# Altium schematic sheet main.SchDoc
size A4
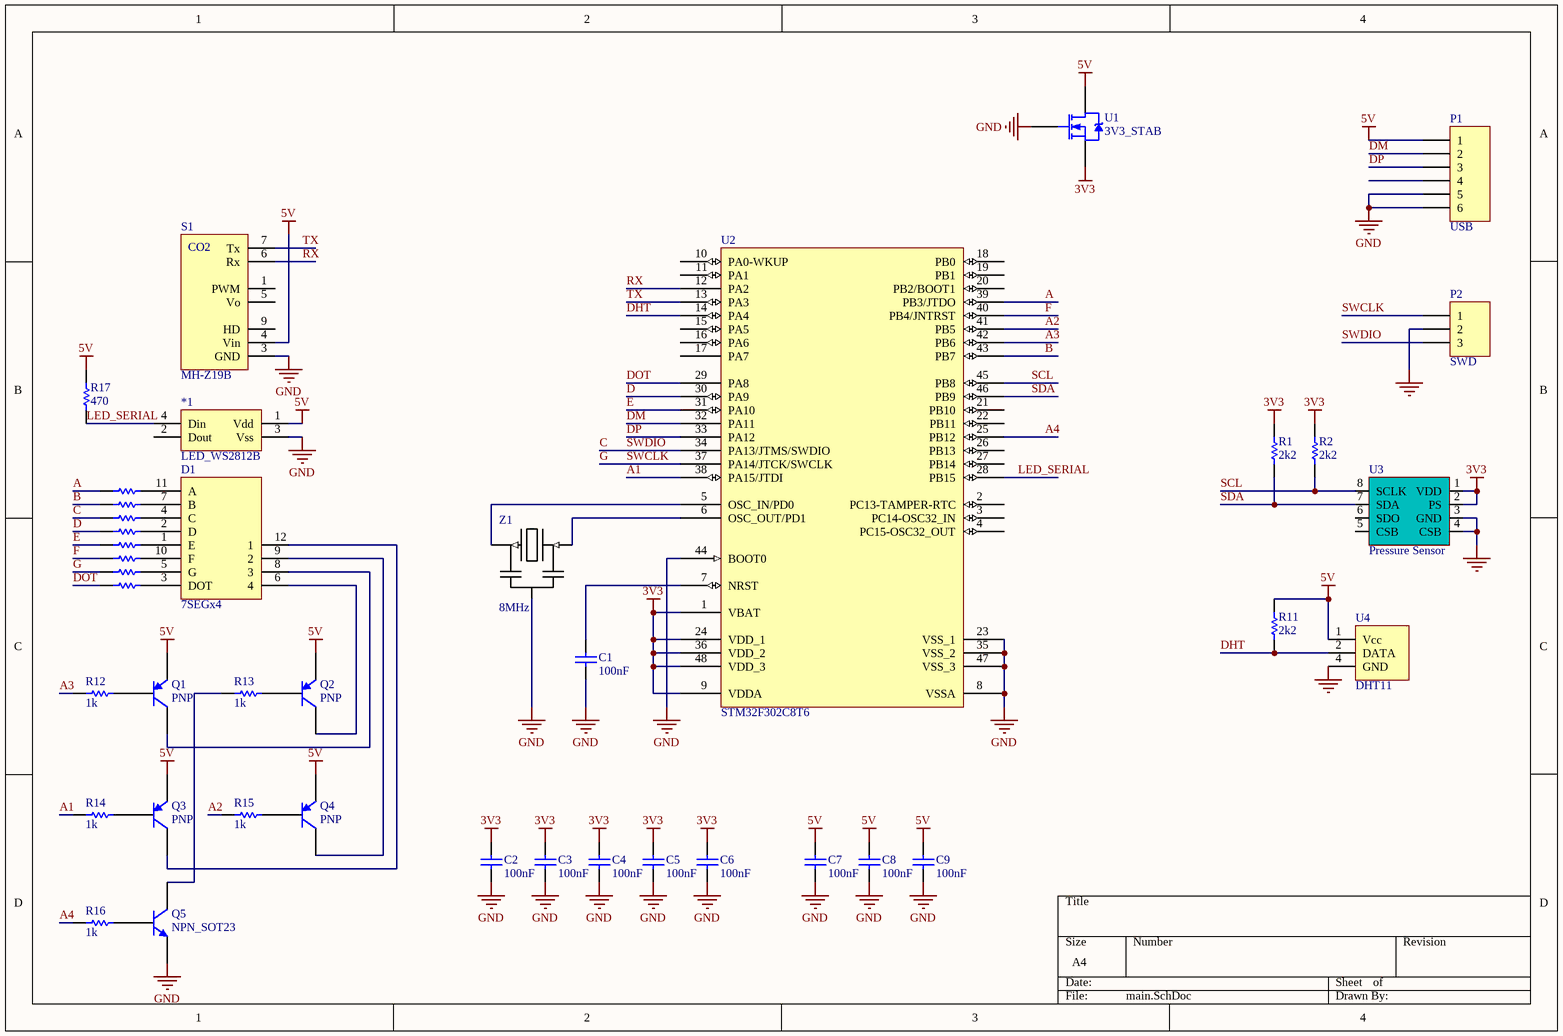
[diagram p0: main.SchDoc]

## Parts
*1  LED_WS2812B  [LED_WS2812b]
C1  100nF  [RC_0603]
C2  100nF  [RC_0603]
C3  100nF  [RC_0603]
C4  100nF  [RC_0603]
C5  100nF  [RC_0603]
C6  100nF  [RC_0603]
C7  100nF  [RC_0603]
C8  100nF  [RC_0603]
C9  100nF  [RC_0603]
D1  7SEGx4  [7SEG_4X_MEDIUM]
P1  USB  [RR_USB_MICRO_#1]
P2  SWD  [MHDR1X3]  (graphical)
Q1  PNP  [SOT-23B_L]
Q2  PNP  [SOT-23B_L]
Q3  PNP  [SOT-23B_L]
Q4  PNP  [SOT-23B_L]
Q5  NPN_SOT23  [SOT-23B_L]
R1  2k2  [RR_0603]
R2  2k2  [RR_0603]
R3  220  [RR_0603]  (value not drawn)
R4  220  [RR_0603]  (value not drawn)
R5  220  [RR_0603]  (value not drawn)
R6  220  [RR_0603]  (value not drawn)
R7  220  [RR_0603]  (value not drawn)
R8  220  [RR_0603]  (value not drawn)
R9  220  [RR_0603]  (value not drawn)
R10  220  [RR_0603]  (value not drawn)
R11  2k2  [RR_0603]
R12  1k  [RR_0603]
R13  1k  [RR_0603]
R14  1k  [RR_0603]
R15  1k  [RR_0603]
R16  1k  [RR_0603]
R17  470  [RR_0603]
S1  MH-Z19B  [MH_Z19B]
U1  3V3_STAB  [RR_SOT-23]
U2  STM32F302C8T6  [LQFP48_N]
U3  Pressure Sensor  [MS5611-01BA03]
U4  DHT11  [DHT11]
Z1  8MHz  [RR_CRYSTAL_3.2X1.3]

## Nets
3V3: C2.2 C3.2 C4.2 C5.2 C6.2 R1.2 R2.2 U1.2(S) U2.1(VBAT) U2.9(VDDA) U2.24(VDD_1) U2.36(VDD_2) U2.48(VDD_3) U3.1(VDD) U3.2(PS)
5V: *1.1(Vdd) C7.2 C8.2 C9.2 P1.1 Q1.2(E) Q2.2(E) Q3.2(E) Q4.2(E) R11.2 R17.2 S1.4(Vin) U1.3(D) U4.1(Vcc)
GND: *1.3(Vss) C1.1 C2.1 C3.1 C4.1 C5.1 C6.1 C7.1 C8.1 C9.1 P1.5 P1.6 P2.2 Q5.2(E) S1.3(GND) U1.1(G) U2.8(VSSA) U2.23(VSS_1) U2.35(VSS_2) U2.44(BOOT0) U2.47(VSS_3) U3.3(GND) U3.4(CSB) U4.4(GND) Z1.2(GND)
A: R3.1 U2.39(PB3/JTDO)
A1: R14.1 U2.38(PA15/JTDI)
A2: R15.1 U2.41(PB5)
A3: R12.1 U2.42(PB6)
A4: R16.1 U2.25(PB12)
B: R4.1 U2.43(PB7)
C: P2.3 R5.1 U2.34(PA13/JTMS/SWDIO)  [also labelled SWDIO]
D: R6.1 U2.30(PA9)
DHT: R11.1 U2.14(PA4) U4.2(DATA)
DM: P1.2 U2.32(PA11)
DOT: R10.1 U2.29(PA8)
DP: P1.3 U2.33(PA12)
E: R7.1 U2.31(PA10)
F: R8.1 U2.40(PB4/JNTRST)
G: P2.1 R9.1 U2.37(PA14/JTCK/SWCLK)  [also labelled SWCLK]
LED_SERIAL: *1.4(Din) R17.1 U2.28(PB15)
RX: S1.6(Rx) U2.12(PA2)
SCL: R2.1 U2.45(PB8) U3.8(SCLK)
SDA: R1.1 U2.46(PB9) U3.7(SDA)
TX: S1.7(Tx) U2.13(PA3)
NetC1_2: C1.2 U2.7(NRST)
NetD1_1: D1.1(E) R7.2
NetD1_2: D1.2(D) R6.2
NetD1_3: D1.3(DOT) R10.2
NetD1_4: D1.4(C) R5.2
NetD1_5: D1.5(G) R9.2
NetD1_6: D1.6(4) Q2.3(C)
NetD1_7: D1.7(B) R4.2
NetD1_8: D1.8(3) Q1.3(C)
NetD1_9: D1.9(2) Q4.3(C)
NetD1_10: D1.10(F) R8.2
NetD1_11: D1.11(A) R3.2
NetD1_12: D1.12(1) Q3.3(C)
NetQ1_1: Q1.1(B) R12.2
NetQ2_1: Q2.1(B) R13.2
NetQ3_1: Q3.1(B) R14.2
NetQ4_1: Q4.1(B) R15.2
NetQ5_1: Q5.1(B) R16.2
NetQ5_3: Q5.3(C) R13.1
NetU2_5: U2.5(OSC_IN/PD0) Z1.1(X1)
NetU2_6: U2.6(OSC_OUT/PD1) Z1.3(X2)

Not connected (* = marked no-connect by the designer): *1 2(Dout); P1 4; S1 1(PWM) 5(Vo) 9(HD); U2 2(PC13-TAMPER-RTC) 3(PC14-OSC32_IN) 4(PC15-OSC32_OUT) 10(PA0-WKUP) 11(PA1) 15(PA5) 16(PA6) 17(PA7) 18(PB0) 19(PB1) 20(PB2/BOOT1) 21(PB10) 22(PB11) 26(PB13) 27(PB14); U3 5(CSB) 6(SDO)

## Notes on the sheet
- (in symbol MH_Z19B) CO2

## Library data of the parts
C1-C9 = Cap: Capacitor
P1 = Header 6: Header, 6-Pin; LatestRevisionDate: 17-Jul-2002; LatestRevisionNote: Re-released for DXP Platform.; Publisher: Altium Limited
P2 = Header 3: Header, 3-Pin; LatestRevisionDate: 17-Jul-2002; LatestRevisionNote: Re-released for DXP Platform.; Publisher: Altium Limited
Q1-Q4 = PNP_SOT23: PNP Bipolar Transistor; Published: 8-Jun-2000; LatestRevisionDate: 29-May-2009; LatestRevisionNote: IPC-7351 Footprint Added.; PackageVersion: Aug-1999; PackageReference: SOT-23B; Publisher: Altium Limited; PackageDescription: 3-Pin SOT-23 Package 0.95 mm Pitch, 2.4 mm Lead Span
Q5 = NPN_SOT23: NPN Bipolar Transistor; Published: 8-Jun-2000; LatestRevisionDate: 17-Jul-2002; LatestRevisionNote: Re-released for DXP Platform.; PackageReference: TO-226-AA; Publisher: Altium Limited; PackageDescription: TO, Flat Index; 3 In-Line, Axial Leads; Body Dia. 4.8mm; Leads 0.55 x 0.51 mm (max); Code_JEDEC: TO-226-AA
R1-R17 = Res1: Resistor
S1 = MH_Z19B
U1 = IRLML2502: MOSFET N-CH 20V 4.2A SOT-23-3; Manufacturer: Infineon Technologies; Order Number: IRLML2502GTRPBF ( IRLML6246TRPBF (INFIN)); Cost: 0,52; Package: SOT-23; Value: MOSFET N-CH 20V 4.2A SOT-23-3
U3 = MS5611-01BA03: Pressure Sensor - MS5611-01BA03
Z1 = CSTCE8M00G55-R0: XTAL 8.0000MHZ 33PF SMD; Manufacturer: Murata Electronics; Value: CER RES 8.0000MHZ 33PF SMD; Order Number: CSTCE8M00G55-R0; Package: 3-SMD 3,2mm x 1,3mm; Cost: 0,48
U2 = STM32F302C8T6: Published: 30-May-2008; DatasheetVersion: rev6, Mar-2008; PackageVersion: Mar-2008; PackageReference: LQFP48; Publisher: Altium Limited; PackageDescription: 48-Pin Low-Profile Quad Flat Pack, 7 x 7 mm Body, 0.5 mm Pitch (LQFP48); ComponentLink1Description: Manufacturer Link; ComponentLink1URL: www.st.com/stm32; ComponentLink2Description: Datasheet; ComponentLink2URL: http://www.st.com/stonline/products/literature/ds/13587.pdf